# Altium schematic sheet tms320f28388d_core_board_support.SchDoc
size A3; SheetNumber: 1; SheetTotal: 5
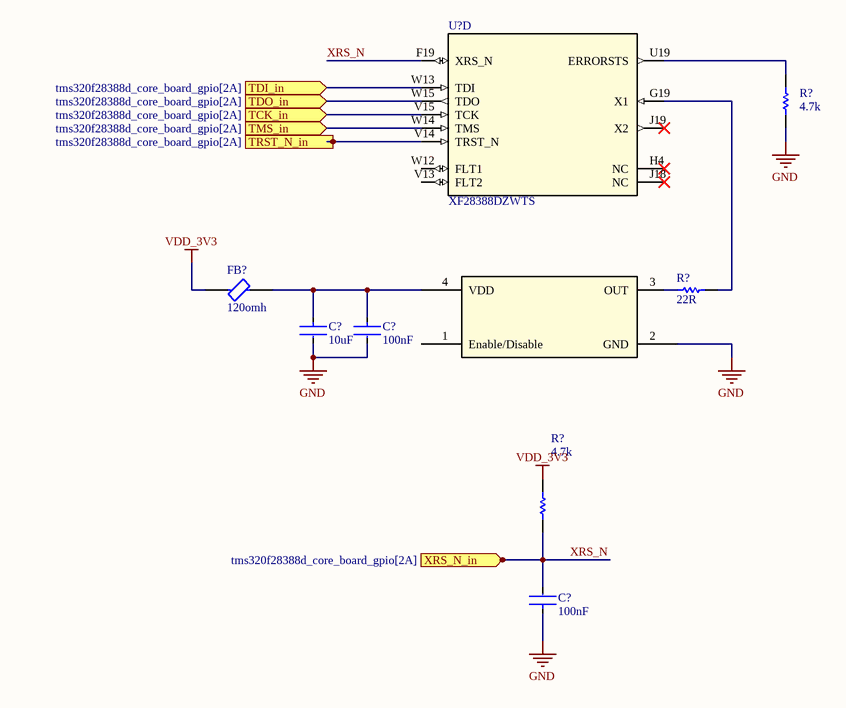
[diagram p0: tms320f28388d_core_board_support.SchDoc]

## Parts
(Parts that share a designator on the sheet are numbered #1, #2 ... from top to bottom, then left to right.)
C?#1  10uF  [FP-CC0402-MFG]
C?#2  100nF  [FP-CC0402-MFG]
C?#3  100nF  [FP-CC0402-MFG]
FB?  120omh  [FP-MMZ1005-MFG]
R?#1  4.7k  [FP-RT0402-MFG]
R?#2  22R  [FP-RC0402-0_4-IPC_A]
R?#3  4.7k  [FP-RT0402-MFG]
U?  XF28388DZWTS  [ZWT0337A-MFG]  (part D of 8)
X??  ot252020mjba4sl  [OSC-SMD_4P-L2.5-W2.0-BL]  (value not drawn)

## Ports
TCK_in (in, see tms320f28388d_core_board_gpio[2A]), TDI_in (in, see tms320f28388d_core_board_gpio[2A]), TDO_in (in, see tms320f28388d_core_board_gpio[2A]), TMS_in (in, see tms320f28388d_core_board_gpio[2A]), TRST_N_in (in, see tms320f28388d_core_board_gpio[2A]), XRS_N_in (in, see tms320f28388d_core_board_gpio[2A])

## Nets
GND: C?#1.2 C?#2.2 C?#3.1 R?#1.2 X??.2(GND)
VDD_3V3: FB?.1 R?#3.1
TCK_in: U?.V15(TCK) ; port TCK_in
TDI_in: U?.W13(TDI) ; port TDI_in
TDO_in: U?.W15(TDO) ; port TDO_in
TMS_in: U?.W14(TMS) ; port TMS_in
TRST_N_in: U?.V14(TRST_N) ; port TRST_N_in
XRS_N: C?#3.2 R?#3.2 U?.F19(XRS_N) ; port XRS_N_in
NetC?#1_1: C?#1.1 C?#2.1 FB?.2 X??.4(VDD)
NetR?#1_1: R?#1.1 U?.U19(ERRORSTS)
NetR?#2_1: R?#2.1 X??.3(OUT)
NetR?#2_2: R?#2.2 U?.G19(X1)

Not connected (* = marked no-connect by the designer): U? H4(NC)* J18(NC)* J19(X2)* V13(FLT2) W12(FLT1); X?? 1(Enable/Disable)

## Library data of the parts
C?#1 = CL05A106MP5NUNC: CAP CER 10UF 10V X5R 0402; Manufacturer: Samsung; Temperature Coefficient: 15%; Tolerance: 20%; Material: Ceramic; Octopart: https://octopart.com/cl05a106mp5nunc-samsung-22457395; Voltage Rating: 10V; RoHS: TRUE; Value: 10uF; Height: 0.7mm; Digikey Description: CAP CER 10UF 10V X5R 0402; Automotive: No; Package: CL05A106MP5NUNC; Device Class L1: Passive Components; Capacitance: 10uF; Temperature Range High: +85°C; ComponentLink2Description: Datasheet; Device Class L2: Capacitors; Temperature Characteristic: X5R; Manufacturer Part Number: CL05A106MP5NUNC; Temperature: -55°C to +85°C; ComponentLink2URL: http://www.samsungsem.com/kr/support/product-search/mlcc/__icsFiles/afieldfile/2019/05/10/19-CL05A106MP5NUNC.pdf; Device Class L3: Ceramic Capacitors; Category: Cap; Temperature Range Low: -55°C; Ipc Land Pattern Name: CAPC10050X50; Lead Free: Yes
C?#2 C?#3 = CC0402KRX7R7BB104: CAP CER 0.1UF 16V X7R 0402; Manufacturer: YAGEO; Material: Ceramic; Automotive Grade: NA; Temperature Coefficient: 30ppm/°C; Tolerance: 0.1; Device Class L1: Passive Components; Temperature Range Low: -55°C; Device Class L3: Ceramic Capacitors; Temperature Characteristic: X7R; Ipc Land Pattern Name: CAPC10050X50; Capacitance: 100 nF; Temperature Range High: +125°C; Voltage Rating: 16 V; Temperature: -55°C to +125°C; RoHS: TRUE; Automotive: No; Height: 0.55mm; Device Class L2: Capacitors; Digikey Description: CAP CER 0.1UF 16V X7R 0402; Package: CC0402; Footprint Url: http://www.yageo.com/exep/pages/download/literatures/UPY-C_GEN_24.pdf; ComponentLink2Description: Datasheet; Category: Cap; Lead Free: Yes; Value: 100 nF; Octopart: https://octopart.com/cc0402krx7r7bb104-yageo-42244624; ComponentLink2URL: http://www.yageo.com/documents/recent/UPY-GP_NP0_16V-to-50V_16.pdf; Manufacturer Part Number: CC0402KRX7R7BB104; Mouser Description: 0402 0.1 uF 16 V ±10 % Tolerance X7R SMT Multilayer Ceramic Capacitor
FB? = MMZ1005S121CT000: Signal Line Ferrite Bead 120Ω @ 100MHz 500mA DCR 220mΩ SMD 0402; DC Resistance (DCR): 250mR; Tolerance: 25%; Impedance: 120R; Series: MMZ; Height: 0.022inch; RoHS Compliant: Yes; Package Quantity: 1; REACH SVHC: No SVHC; Lead Free: Lead Free; Current Rating: 500mA; Packaging: Tape and Reel; Case Code (Imperial): 0402; Width: 0.02inch; Max DC Current: 500mA; Core Material: Ferrite; Case Code (Metric): 1005; Depth: 0.5mm; Case/Package: 0402; Mount: Surface Mount; Length: 0.039inch
R?#1 R?#3 = RT0402BRD074K7L: RES SMD 4.7K OHM 0.1% 1/16W 0402; Manufacturer: Yageo; Voltage Rating: 50V; Temperature Coefficient: 25 ppm/°C; Resistance: 4.7KΩ; Tolerance: 0.001; Power Rating: 0.063W; Value: 4.7KΩ; Device Class L2: Resistors; Composition: Thin Film; Octopart: https://octopart.com/rt0402brd074k7l-yageo-1415343; Mouser Description: Thin Film Resistors 1/16W 4.7K ohm .1% 25ppm; Lead Free: Yes; Height: 0.35mm; Automotive: No; Series: RT; Ipc Land Pattern Name: RESC10050X30; Package: RT0402; Category: Res; Temperature Range High: +155°C; Footprint Url: http://www.yageo.com/exep/pages/download/literatures/PYu-R_Mount_10.pdf; Temperature Range Low: -55°C; Device Class L3: Chip SMD Resistors; Manufacturer Part Number: RT0402BRD074K7L; RoHS: TRUE; ComponentLink2URL: http://www.yageo.com/documents/recent/PYu-RT_1-to-0.01_RoHS_L_9.pdf; Digikey Description: RES SMD 4.7K OHM 0.1% 1/16W 0402; Temperature: -55°C to +155°C; Device Class L1: Passive Components; ComponentLink2Description: Datasheet
R?#2 = CMP-2002-07520-2: Tolerance: 1%; Power Rating: 63mW; Voltage Rating: 50V; Temperature Coefficient: 100ppm/°C; Resistance: 22Ω; Termination: SMD/SMT; Depth: 500µm; Packaging: Tape & Reel; Height: 400µm; Width: 500µm; Case Code (Imperial): 0402; Length: 1mm; Schedule B: 8533210045, 8533210045|8533210045|8533210045|8533210045|8533210045|8533210045|8533210045|8533210045, 8533210045|8533210045|8533210045|8533210045|8533210045|8533210045|8533210045|8533210045|8533210045, 8533210045|8533210045|8533210045|8533210045|8533210045|8533210045|8533210045|8533210045|8533210045|8533210045; Case/Package: 0402; Max Operating Temperature: 155°C; Min Operating Temperature: -55°C; REACH SVHC: Unknown; RoHS: Compliant; Military Standard: Not; Voltage Rating (DC): 50V; Lead Free: Lead Free; Voltage Rating (AC): 50V; Number of Pins: 2; Composition: Thick Film
U? = XF28388DZWTS: C2000 32-bit MCU w/ connectivity manager, 2x C28x+CLA CPU, 1.5 MB flash, FPU64, CLB, ENET, EtherCAT 337-NFBGA -40 to 125; Manufacturer_Name: Texas Instruments; TYPE: TYPE; RefDes: RefDes; Copyright: Copyright (C) 2026 Ultra Librarian. All rights reserved.; Manufacturer_Part_Number: XF28388DZWTS
X?? = OT252020MJBA4SL: 频率:20MHz;常温频差:±10ppm;输出模式:CMOS;工作电压:1.8V~3.3V;工作电流:4mA;频率稳定度:±20ppm;; Manufacturer: YXC(扬兴晶振); AddInBom: yes; ModelId: 6c59bf18646c482ead3932fe5df36485; ModelName: OSC-SMD_4P-L2.5-W2.0-H0.6; ModelTransform: 98.425,78.74,0,0,0,0,0.0005,0,0; Value: 20MHz; Normal temperature Frequency Tolerance: ±10ppm; Output Type: CMOS; Current - Supply: 4mA; Frequency Stability: ±20ppm; Symbol: OT252020MJBA4SL; LCSC Part Name: YSO110TR 20MHZ 1.8V-3.3V ±10PPM -40~85℃（±20PPM) CMOS; SupplierPart: C669067; ManufacturerPart: OT252020MJBA4SL; Supplier Footprint: SMD2520-4P; JLCPCB Part Class: Extended Part; Datasheet: https://item.szlcsc.com/datasheet/OT252020MJBA4SL/699167.html; Supplier: LCSC; ConvertToPcb: yes; FootprintName: OSC-SMD_4P-L2.5-W2.0-BL; Voltage - Supply: 1.8V~3.3V; Operating Temperature: -40℃~+85℃